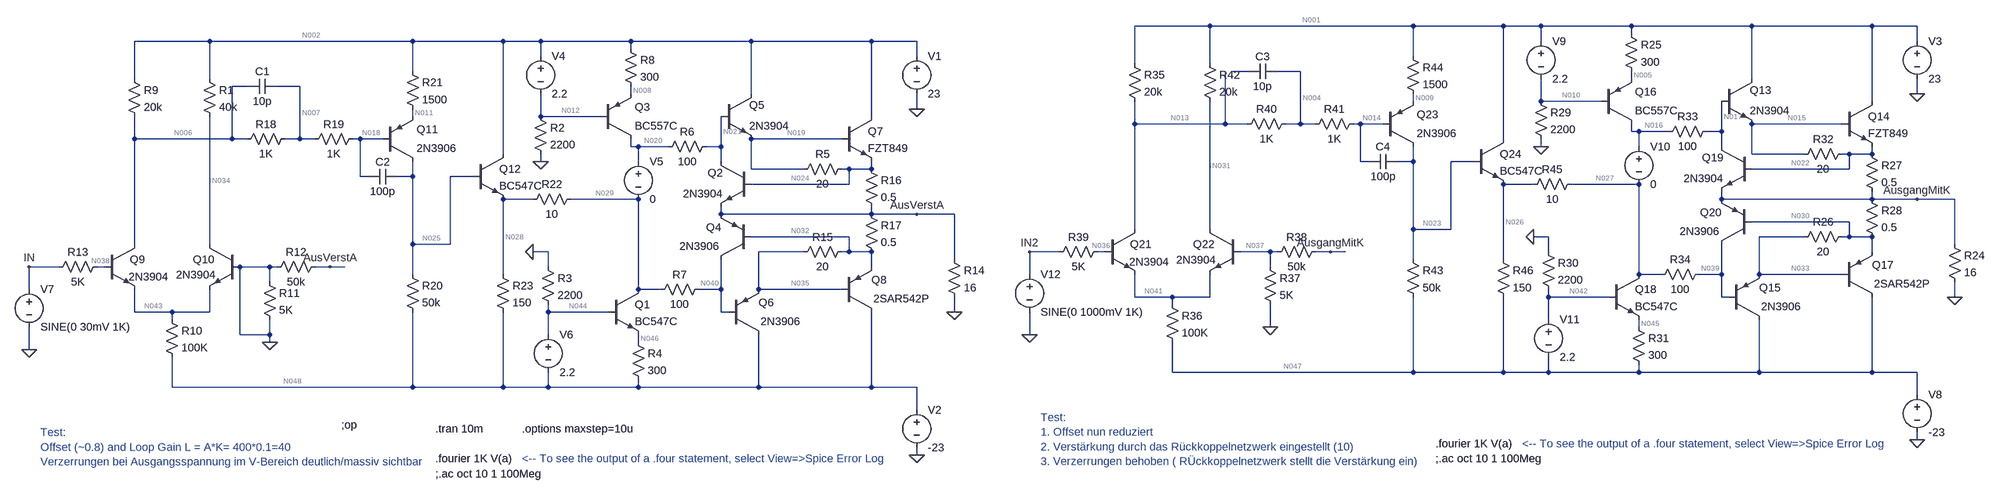
[diagram p0: schematic audioampFH2Trans.asc]
audioampFH2Trans.asc, the LTspice schematic file:
Version 4
SHEET 1 2516 2032
WIRE -448 880 -608 880
WIRE -16 880 -448 880
WIRE 176 880 -16 880
WIRE 256 880 176 880
WIRE 448 880 256 880
WIRE 704 880 448 880
WIRE 960 880 704 880
WIRE 1056 880 960 880
WIRE 448 896 448 880
WIRE -2576 912 -2736 912
WIRE -2144 912 -2576 912
WIRE -1952 912 -2144 912
WIRE -1872 912 -1952 912
WIRE -1680 912 -1872 912
WIRE -1424 912 -1680 912
WIRE -1168 912 -1424 912
WIRE -1072 912 -1168 912
WIRE 256 912 256 880
WIRE 1056 912 1056 880
WIRE -1680 928 -1680 912
WIRE -1872 944 -1872 912
WIRE -1072 944 -1072 912
WIRE -16 944 -16 880
WIRE -608 960 -608 880
WIRE -448 960 -448 880
WIRE -2144 976 -2144 912
WIRE -368 976 -400 976
WIRE -256 976 -304 976
WIRE -2736 992 -2736 912
WIRE -2576 992 -2576 912
WIRE 448 992 448 976
WIRE 704 992 704 880
WIRE -2496 1008 -2528 1008
WIRE -2384 1008 -2432 1008
WIRE -1680 1024 -1680 1008
WIRE -1424 1024 -1424 912
WIRE 1056 1024 1056 992
WIRE -16 1040 -16 1024
WIRE 256 1040 256 992
WIRE 384 1040 256 1040
WIRE 960 1040 960 880
WIRE -1072 1056 -1072 1024
WIRE -2144 1072 -2144 1056
WIRE -1872 1072 -1872 1024
WIRE -1744 1072 -1872 1072
WIRE -1168 1072 -1168 912
WIRE -608 1088 -608 1040
WIRE -416 1088 -416 976
WIRE -416 1088 -608 1088
WIRE -368 1088 -416 1088
WIRE -256 1088 -256 976
WIRE -256 1088 -288 1088
WIRE -224 1088 -256 1088
WIRE -128 1088 -144 1088
WIRE -80 1088 -128 1088
WIRE 896 1088 704 1088
WIRE 448 1104 448 1088
WIRE 464 1104 448 1104
WIRE 528 1104 464 1104
WIRE 640 1104 640 1040
WIRE 640 1104 608 1104
WIRE -2736 1120 -2736 1072
WIRE -2528 1120 -2528 1008
WIRE -2528 1120 -2736 1120
WIRE -2496 1120 -2528 1120
WIRE -2384 1120 -2384 1008
WIRE -2384 1120 -2416 1120
WIRE -2352 1120 -2384 1120
WIRE -2256 1120 -2272 1120
WIRE -2208 1120 -2256 1120
WIRE -1232 1120 -1424 1120
WIRE 176 1120 176 880
WIRE -1680 1136 -1680 1120
WIRE -1664 1136 -1680 1136
WIRE -1600 1136 -1664 1136
WIRE -1488 1136 -1488 1072
WIRE -1488 1136 -1520 1136
WIRE 256 1136 256 1120
WIRE 464 1136 464 1104
WIRE 640 1136 640 1104
WIRE -1952 1152 -1952 912
WIRE 704 1152 704 1088
WIRE 816 1152 704 1152
WIRE 912 1152 896 1152
WIRE 960 1152 960 1136
WIRE 960 1152 912 1152
WIRE -1872 1168 -1872 1152
WIRE -1664 1168 -1664 1136
WIRE -1488 1168 -1488 1136
WIRE -128 1168 -128 1088
WIRE -112 1168 -128 1168
WIRE -16 1168 -16 1136
WIRE -16 1168 -48 1168
WIRE 112 1168 64 1168
WIRE -1424 1184 -1424 1120
WIRE -1312 1184 -1424 1184
WIRE -1216 1184 -1232 1184
WIRE -1168 1184 -1168 1168
WIRE -1168 1184 -1216 1184
WIRE 912 1184 912 1152
WIRE 912 1184 704 1184
WIRE -2256 1200 -2256 1120
WIRE -2240 1200 -2256 1200
WIRE -2144 1200 -2144 1168
WIRE -2144 1200 -2176 1200
WIRE -2016 1200 -2064 1200
WIRE -1216 1216 -1216 1184
WIRE -1216 1216 -1424 1216
WIRE 240 1216 176 1216
WIRE 464 1216 320 1216
WIRE -1888 1248 -1952 1248
WIRE -1664 1248 -1808 1248
WIRE 640 1248 640 1232
WIRE 960 1248 960 1232
WIRE 960 1248 640 1248
WIRE 1056 1248 960 1248
WIRE 1136 1248 1056 1248
WIRE -1488 1280 -1488 1264
WIRE -1168 1280 -1168 1264
WIRE -1168 1280 -1488 1280
WIRE -1072 1280 -1168 1280
WIRE -992 1280 -1072 1280
WIRE 912 1296 704 1296
WIRE -608 1312 -608 1088
WIRE -448 1312 -448 1040
WIRE -16 1312 -16 1168
WIRE 64 1312 64 1168
WIRE 64 1312 -16 1312
WIRE -1216 1328 -1424 1328
WIRE 272 1328 240 1328
WIRE 816 1328 720 1328
WIRE 912 1328 912 1296
WIRE 912 1328 896 1328
WIRE 960 1328 912 1328
WIRE -2736 1344 -2736 1120
WIRE -2576 1344 -2576 1072
WIRE -2144 1344 -2144 1200
WIRE -2064 1344 -2064 1200
WIRE -2064 1344 -2144 1344
WIRE 1136 1344 1136 1248
WIRE -1856 1360 -1888 1360
WIRE -1312 1360 -1408 1360
WIRE -1216 1360 -1216 1328
WIRE -1216 1360 -1232 1360
WIRE -1168 1360 -1216 1360
WIRE -768 1360 -832 1360
WIRE -672 1360 -688 1360
WIRE -320 1360 -384 1360
WIRE -304 1360 -320 1360
WIRE -192 1360 -224 1360
WIRE -160 1360 -192 1360
WIRE 272 1360 272 1328
WIRE 960 1360 960 1328
WIRE -992 1376 -992 1280
WIRE -16 1376 -16 1312
WIRE 176 1376 176 1216
WIRE -2896 1392 -2960 1392
WIRE -2800 1392 -2816 1392
WIRE -2448 1392 -2512 1392
WIRE -2432 1392 -2448 1392
WIRE -2320 1392 -2352 1392
WIRE -2288 1392 -2320 1392
WIRE -1856 1392 -1856 1360
WIRE -1168 1392 -1168 1360
WIRE -320 1392 -320 1360
WIRE -2144 1408 -2144 1344
WIRE -1952 1408 -1952 1248
WIRE -832 1408 -832 1360
WIRE 464 1408 464 1216
WIRE 512 1408 464 1408
WIRE 640 1408 640 1344
WIRE 640 1408 592 1408
WIRE 720 1408 720 1328
WIRE 896 1408 720 1408
WIRE -2448 1424 -2448 1392
WIRE -2960 1440 -2960 1392
WIRE -1664 1440 -1664 1248
WIRE -1616 1440 -1664 1440
WIRE -1488 1440 -1488 1376
WIRE -1488 1440 -1536 1440
WIRE -1408 1440 -1408 1360
WIRE -1232 1440 -1408 1440
WIRE -608 1456 -608 1408
WIRE -528 1456 -608 1456
WIRE -448 1456 -448 1408
WIRE -448 1456 -528 1456
WIRE 272 1456 272 1440
WIRE 400 1456 272 1456
WIRE 640 1456 640 1408
WIRE 656 1456 640 1456
WIRE 1136 1456 1136 1424
WIRE -528 1472 -528 1456
WIRE -2736 1488 -2736 1440
WIRE -2656 1488 -2736 1488
WIRE -2576 1488 -2576 1440
WIRE -2576 1488 -2656 1488
WIRE -1856 1488 -1856 1472
WIRE -1728 1488 -1856 1488
WIRE -1488 1488 -1488 1440
WIRE -1472 1488 -1488 1488
WIRE -992 1488 -992 1456
WIRE -2656 1504 -2656 1488
WIRE 272 1504 272 1456
WIRE -320 1520 -320 1472
WIRE 464 1520 464 1504
WIRE -2512 1536 -2512 1392
WIRE -2448 1536 -2448 1504
WIRE -2448 1536 -2512 1536
WIRE -1856 1536 -1856 1488
WIRE -832 1536 -832 1488
WIRE -2448 1552 -2448 1536
WIRE -1664 1552 -1664 1536
WIRE -2960 1568 -2960 1520
WIRE -528 1616 -528 1552
WIRE -16 1616 -16 1456
WIRE -16 1616 -528 1616
WIRE 176 1616 176 1456
WIRE 176 1616 -16 1616
WIRE 272 1616 272 1584
WIRE 272 1616 176 1616
WIRE 464 1616 464 1600
WIRE 464 1616 272 1616
WIRE 720 1616 720 1504
WIRE 720 1616 464 1616
WIRE 960 1616 960 1456
WIRE 960 1616 720 1616
WIRE 1056 1616 960 1616
WIRE -2656 1648 -2656 1584
WIRE -2144 1648 -2144 1488
WIRE -2144 1648 -2656 1648
WIRE -1952 1648 -1952 1488
WIRE -1952 1648 -2144 1648
WIRE -1856 1648 -1856 1616
WIRE -1856 1648 -1952 1648
WIRE -1664 1648 -1664 1632
WIRE -1664 1648 -1856 1648
WIRE -1408 1648 -1408 1536
WIRE -1408 1648 -1664 1648
WIRE -1168 1648 -1168 1488
WIRE -1168 1648 -1408 1648
WIRE -1072 1648 -1168 1648
WIRE 1056 1664 1056 1616
WIRE -1072 1696 -1072 1648
WIRE 1056 1760 1056 1744
WIRE -1072 1792 -1072 1776
FLAG -1072 1056 0
FLAG -1072 1792 0
FLAG -992 1488 0
FLAG -1872 1168 0
FLAG -1888 1360 0
FLAG -1072 1280 AusVerstA
FLAG -2448 1552 0
FLAG -2960 1568 0
FLAG -2320 1392 AusVerstA
FLAG -2960 1392 IN
FLAG 1056 1024 0
FLAG 1056 1760 0
FLAG 1136 1456 0
FLAG 256 1136 0
FLAG 240 1328 0
FLAG 1056 1248 AusgangMitK
FLAG -320 1520 0
FLAG -832 1536 0
FLAG -192 1360 AusgangMitK
FLAG -832 1360 IN2
SYMBOL NPN -1488 1024 R0
WINDOW 0 60 24 Left 2
WINDOW 3 60 68 Left 2
SYMATTR InstName Q5
SYMATTR Value 2N3904
SYMBOL npn -1232 1072 R0
SYMATTR InstName Q7
SYMATTR Value FZT849
SYMBOL PNP -1472 1536 M180
WINDOW 0 64 68 Left 2
WINDOW 3 68 28 Left 2
SYMATTR InstName Q6
SYMATTR Value 2N3906
SYMBOL VOLTAGE -1072 928 R0
WINDOW 123 0 0 Left 2
WINDOW 39 0 0 Left 2
SYMATTR InstName V1
SYMATTR Value 23
SYMBOL voltage -1072 1680 R0
WINDOW 123 0 0 Left 2
WINDOW 39 0 0 Left 2
SYMATTR InstName V2
SYMATTR Value -23
SYMBOL res -1008 1360 R0
SYMATTR InstName R14
SYMATTR Value 16
SYMBOL pnp -1744 1120 M180
WINDOW 0 72 68 Left 2
WINDOW 3 72 28 Left 2
SYMATTR InstName Q3
SYMATTR Value BC557C
SYMBOL res -1696 912 R0
SYMATTR InstName R8
SYMATTR Value 300
SYMBOL PNP -1232 1488 M180
WINDOW 0 64 68 Left 2
WINDOW 3 68 28 Left 2
SYMATTR InstName Q8
SYMATTR Value 2SAR542P
SYMBOL res -1216 1344 R90
WINDOW 0 0 56 VBottom 2
WINDOW 3 32 56 VTop 2
SYMATTR InstName R15
SYMATTR Value 20
SYMBOL res -1184 1168 R0
SYMATTR InstName R16
SYMATTR Value 0.5
SYMBOL res -1184 1264 R0
SYMATTR InstName R17
SYMATTR Value 0.5
SYMBOL VOLTAGE -1872 928 R0
WINDOW 123 0 0 Left 2
WINDOW 39 0 0 Left 2
SYMATTR InstName V4
SYMATTR Value 2.2
SYMBOL res -1888 1056 R0
SYMATTR InstName R2
SYMATTR Value 2200
SYMBOL VOLTAGE -1664 1152 R0
WINDOW 123 0 0 Left 2
WINDOW 39 0 0 Left 2
SYMATTR InstName V5
SYMATTR Value 0
SYMBOL VOLTAGE -1856 1520 R0
WINDOW 123 0 0 Left 2
WINDOW 39 0 0 Left 2
SYMATTR InstName V6
SYMATTR Value 2.2
SYMBOL res -1872 1376 R0
SYMATTR InstName R3
SYMATTR Value 2200
SYMBOL res -1680 1536 R0
SYMATTR InstName R4
SYMATTR Value 300
SYMBOL npn -1728 1440 R0
SYMATTR InstName Q1
SYMATTR Value BC547C
SYMBOL res -1216 1168 R90
WINDOW 0 0 56 VBottom 2
WINDOW 3 32 56 VTop 2
SYMATTR InstName R5
SYMATTR Value 20
SYMBOL NPN -1424 1168 M0
WINDOW 0 60 24 Left 2
WINDOW 3 60 68 Left 2
SYMATTR InstName Q2
SYMATTR Value 2N3904
SYMBOL PNP -1424 1376 R180
WINDOW 0 64 68 Left 2
WINDOW 3 68 28 Left 2
SYMATTR InstName Q4
SYMATTR Value 2N3906
SYMBOL res -1504 1120 R90
WINDOW 0 0 56 VBottom 2
WINDOW 3 32 56 VTop 2
SYMATTR InstName R6
SYMATTR Value 100
SYMBOL res -1520 1424 R90
WINDOW 0 0 56 VBottom 2
WINDOW 3 32 56 VTop 2
SYMATTR InstName R7
SYMATTR Value 100
SYMBOL npn -2800 1344 R0
WINDOW 0 54 32 Left 2
WINDOW 3 52 69 Left 2
SYMATTR InstName Q9
SYMATTR Value 2N3904
SYMBOL npn -2512 1344 M0
WINDOW 0 54 32 Left 2
WINDOW 3 51 65 Left 2
SYMATTR InstName Q10
SYMATTR Value 2N3904
SYMBOL res -2752 976 R0
SYMATTR InstName R9
SYMATTR Value 20k
SYMBOL res -2672 1488 R0
SYMATTR InstName R10
SYMATTR Value 100K
SYMBOL res -2464 1408 R0
SYMATTR InstName R11
SYMATTR Value 5K
SYMBOL res -2336 1376 R90
WINDOW 0 0 56 VBottom 2
WINDOW 3 32 56 VTop 2
SYMATTR InstName R12
SYMATTR Value 50k
SYMBOL voltage -2960 1424 R0
WINDOW 123 0 0 Left 2
WINDOW 39 0 0 Left 2
SYMATTR InstName V7
SYMATTR Value SINE(0 30mV 1K)
SYMBOL res -2800 1376 R90
WINDOW 0 0 56 VBottom 2
WINDOW 3 32 56 VTop 2
SYMATTR InstName R13
SYMATTR Value 5K
SYMBOL res -2400 1104 R90
WINDOW 0 0 56 VBottom 2
WINDOW 3 32 56 VTop 2
SYMATTR InstName R18
SYMATTR Value 1K
SYMBOL cap -2432 992 R90
WINDOW 0 0 32 VBottom 2
WINDOW 3 32 32 VTop 2
SYMATTR InstName C1
SYMATTR Value 10p
SYMBOL res -2256 1104 R90
WINDOW 0 0 56 VBottom 2
WINDOW 3 32 56 VTop 2
SYMATTR InstName R19
SYMATTR Value 1K
SYMBOL res -2592 976 R0
SYMATTR InstName R1
SYMATTR Value 40k
SYMBOL res -2160 1392 R0
SYMATTR InstName R20
SYMATTR Value 50k
SYMBOL pnp -2208 1168 M180
WINDOW 0 72 68 Left 2
WINDOW 3 72 28 Left 2
SYMATTR InstName Q11
SYMATTR Value 2N3906
SYMBOL res -2160 960 R0
SYMATTR InstName R21
SYMATTR Value 1500
SYMBOL cap -2176 1184 R90
WINDOW 0 0 32 VBottom 2
WINDOW 3 32 32 VTop 2
SYMATTR InstName C2
SYMATTR Value 100p
SYMBOL res -1792 1232 R90
WINDOW 0 0 56 VBottom 2
WINDOW 3 32 56 VTop 2
SYMATTR InstName R22
SYMATTR Value 10
SYMBOL npn -2016 1152 R0
SYMATTR InstName Q12
SYMATTR Value BC547C
SYMBOL res -1968 1392 R0
SYMATTR InstName R23
SYMATTR Value 150
SYMBOL NPN 640 992 R0
WINDOW 0 60 24 Left 2
WINDOW 3 60 68 Left 2
SYMATTR InstName Q13
SYMATTR Value 2N3904
SYMBOL npn 896 1040 R0
SYMATTR InstName Q14
SYMATTR Value FZT849
SYMBOL PNP 656 1504 M180
WINDOW 0 64 68 Left 2
WINDOW 3 68 28 Left 2
SYMATTR InstName Q15
SYMATTR Value 2N3906
SYMBOL VOLTAGE 1056 896 R0
WINDOW 123 0 0 Left 2
WINDOW 39 0 0 Left 2
SYMATTR InstName V3
SYMATTR Value 23
SYMBOL voltage 1056 1648 R0
WINDOW 123 0 0 Left 2
WINDOW 39 0 0 Left 2
SYMATTR InstName V8
SYMATTR Value -23
SYMBOL res 1120 1328 R0
SYMATTR InstName R24
SYMATTR Value 16
SYMBOL pnp 384 1088 M180
WINDOW 0 72 68 Left 2
WINDOW 3 72 28 Left 2
SYMATTR InstName Q16
SYMATTR Value BC557C
SYMBOL res 432 880 R0
SYMATTR InstName R25
SYMATTR Value 300
SYMBOL PNP 896 1456 M180
WINDOW 0 64 68 Left 2
WINDOW 3 68 28 Left 2
SYMATTR InstName Q17
SYMATTR Value 2SAR542P
SYMBOL res 912 1312 R90
WINDOW 0 0 56 VBottom 2
WINDOW 3 32 56 VTop 2
SYMATTR InstName R26
SYMATTR Value 20
SYMBOL res 944 1136 R0
SYMATTR InstName R27
SYMATTR Value 0.5
SYMBOL res 944 1232 R0
SYMATTR InstName R28
SYMATTR Value 0.5
SYMBOL VOLTAGE 256 896 R0
WINDOW 123 0 0 Left 2
WINDOW 39 0 0 Left 2
SYMATTR InstName V9
SYMATTR Value 2.2
SYMBOL res 240 1024 R0
SYMATTR InstName R29
SYMATTR Value 2200
SYMBOL VOLTAGE 464 1120 R0
WINDOW 123 0 0 Left 2
WINDOW 39 0 0 Left 2
SYMATTR InstName V10
SYMATTR Value 0
SYMBOL VOLTAGE 272 1488 R0
WINDOW 123 0 0 Left 2
WINDOW 39 0 0 Left 2
SYMATTR InstName V11
SYMATTR Value 2.2
SYMBOL res 256 1344 R0
SYMATTR InstName R30
SYMATTR Value 2200
SYMBOL res 448 1504 R0
SYMATTR InstName R31
SYMATTR Value 300
SYMBOL npn 400 1408 R0
SYMATTR InstName Q18
SYMATTR Value BC547C
SYMBOL res 912 1136 R90
WINDOW 0 0 56 VBottom 2
WINDOW 3 32 56 VTop 2
SYMATTR InstName R32
SYMATTR Value 20
SYMBOL NPN 704 1136 M0
WINDOW 0 60 24 Left 2
WINDOW 3 60 68 Left 2
SYMATTR InstName Q19
SYMATTR Value 2N3904
SYMBOL PNP 704 1344 R180
WINDOW 0 64 68 Left 2
WINDOW 3 68 28 Left 2
SYMATTR InstName Q20
SYMATTR Value 2N3906
SYMBOL res 624 1088 R90
WINDOW 0 0 56 VBottom 2
WINDOW 3 32 56 VTop 2
SYMATTR InstName R33
SYMATTR Value 100
SYMBOL res 608 1392 R90
WINDOW 0 0 56 VBottom 2
WINDOW 3 32 56 VTop 2
SYMATTR InstName R34
SYMATTR Value 100
SYMBOL npn -672 1312 R0
WINDOW 0 54 32 Left 2
WINDOW 3 52 69 Left 2
SYMATTR InstName Q21
SYMATTR Value 2N3904
SYMBOL npn -384 1312 M0
WINDOW 0 54 32 Left 2
WINDOW 3 51 65 Left 2
SYMATTR InstName Q22
SYMATTR Value 2N3904
SYMBOL res -624 944 R0
SYMATTR InstName R35
SYMATTR Value 20k
SYMBOL res -544 1456 R0
SYMATTR InstName R36
SYMATTR Value 100K
SYMBOL res -336 1376 R0
SYMATTR InstName R37
SYMATTR Value 5K
SYMBOL res -208 1344 R90
WINDOW 0 0 56 VBottom 2
WINDOW 3 32 56 VTop 2
SYMATTR InstName R38
SYMATTR Value 50k
SYMBOL voltage -832 1392 R0
WINDOW 123 0 0 Left 2
WINDOW 39 0 0 Left 2
SYMATTR InstName V12
SYMATTR Value SINE(0 1000mV 1K)
SYMBOL res -672 1344 R90
WINDOW 0 0 56 VBottom 2
WINDOW 3 32 56 VTop 2
SYMATTR InstName R39
SYMATTR Value 5K
SYMBOL res -272 1072 R90
WINDOW 0 0 56 VBottom 2
WINDOW 3 32 56 VTop 2
SYMATTR InstName R40
SYMATTR Value 1K
SYMBOL cap -304 960 R90
WINDOW 0 0 32 VBottom 2
WINDOW 3 32 32 VTop 2
SYMATTR InstName C3
SYMATTR Value 10p
SYMBOL res -128 1072 R90
WINDOW 0 0 56 VBottom 2
WINDOW 3 32 56 VTop 2
SYMATTR InstName R41
SYMATTR Value 1K
SYMBOL res -464 944 R0
SYMATTR InstName R42
SYMATTR Value 20k
SYMBOL res -32 1360 R0
SYMATTR InstName R43
SYMATTR Value 50k
SYMBOL pnp -80 1136 M180
WINDOW 0 72 68 Left 2
WINDOW 3 72 28 Left 2
SYMATTR InstName Q23
SYMATTR Value 2N3906
SYMBOL res -32 928 R0
SYMATTR InstName R44
SYMATTR Value 1500
SYMBOL cap -48 1152 R90
WINDOW 0 0 32 VBottom 2
WINDOW 3 32 32 VTop 2
SYMATTR InstName C4
SYMATTR Value 100p
SYMBOL res 336 1200 R90
WINDOW 0 0 56 VBottom 2
WINDOW 3 32 56 VTop 2
SYMATTR InstName R45
SYMATTR Value 10
SYMBOL npn 112 1120 R0
SYMATTR InstName Q24
SYMATTR Value BC547C
SYMBOL res 160 1360 R0
SYMATTR InstName R46
SYMATTR Value 150
TEXT -2096 1736 Left 2 !.tran 10m
TEXT -1912 1736 Left 2 !.options maxstep=10u
TEXT -2096 1832 Left 2 !;.ac oct 10 1 100Meg
TEXT -2096 1800 Left 2 !.fourier 1K V(a)
TEXT -1912 1800 Left 2 ;<-- To see the output of a .four statement, select View=>Spice Error Log
TEXT -2296 1728 Left 2 !;op
TEXT -2936 1744 Left 2 ;Test:\nOffset (~0.8) and Loop Gain L = A*K= 400*0.1=40\nVerzerrungen bei Ausgangsspannung im V-Bereich deutlich/massiv sichtbar
TEXT 32 1800 Left 2 !;.ac oct 10 1 100Meg
TEXT 32 1768 Left 2 !.fourier 1K V(a)
TEXT 216 1768 Left 2 ;<-- To see the output of a .four statement, select View=>Spice Error Log
TEXT -808 1712 Left 2 ;Test:\n1. Offset nun reduziert\n2. Verstärkung durch das Rückkoppelnetzwerk eingestellt (10)\n3. Verzerrungen behoben ( RÜckkoppelnetzwerk stellt die Verstärkung ein)

The netlist it stands for:
* audioampFH2Trans.asc
Q5 N002 N021 N019 0 2N3904
Q7 N002 N019 N024 0 FZT849
Q6 N048 N040 N035 0 2N3906
V1 N002 0 23
V2 N048 0 -23
R14 AusVerstA 0 16
Q3 N020 N012 N008 0 BC557C
R8 N002 N008 300
Q8 N048 N035 N032 0 2SAR542P
R15 N032 N035 20
R16 N024 AusVerstA 0.5
R17 AusVerstA N032 0.5
V4 N002 N012 2.2
R2 N012 0 2200
V5 N020 N029 0
V6 N044 N048 2.2
R3 0 N044 2200
R4 N046 N048 300
Q1 N029 N044 N046 0 BC547C
R5 N024 N019 20
Q2 N021 N024 AusVerstA 0 2N3904
Q4 N040 N032 AusVerstA 0 2N3906
R6 N021 N020 100
R7 N040 N029 100
Q9 N006 N038 N043 0 2N3904
Q10 N034 0 N043 0 2N3904
R9 N002 N006 20k
R10 N043 N048 100K
R11 0 0 5K
R12 AusVerstA 0 50k
V7 IN 0 SINE(0 30mV 1K)
R13 N038 IN 5K
R18 N007 N006 1K
C1 N007 N006 10p
R19 N018 N007 1K
R1 N002 N034 40k
R20 N025 N048 50k
Q11 N025 N018 N011 0 2N3906
R21 N002 N011 1500
C2 N025 N018 100p
R22 N029 N028 10
Q12 N002 N025 N028 0 BC547C
R23 N028 N048 150
Q13 N001 N017 N015 0 2N3904
Q14 N001 N015 N022 0 FZT849
Q15 N047 N039 N033 0 2N3906
V3 N001 0 23
V8 N047 0 -23
R24 AusgangMitK 0 16
Q16 N016 N010 N005 0 BC557C
R25 N001 N005 300
Q17 N047 N033 N030 0 2SAR542P
R26 N030 N033 20
R27 N022 AusgangMitK 0.5
R28 AusgangMitK N030 0.5
V9 N001 N010 2.2
R29 N010 0 2200
V10 N016 N027 0
V11 N042 N047 2.2
R30 0 N042 2200
R31 N045 N047 300
Q18 N027 N042 N045 0 BC547C
R32 N022 N015 20
Q19 N017 N022 AusgangMitK 0 2N3904
Q20 N039 N030 AusgangMitK 0 2N3906
R33 N017 N016 100
R34 N039 N027 100
Q21 N013 N036 N041 0 2N3904
Q22 N031 N037 N041 0 2N3904
R35 N001 N013 20k
R36 N041 N047 100K
R37 N037 0 5K
R38 AusgangMitK N037 50k
V12 IN2 0 SINE(0 1000mV 1K)
R39 N036 IN2 5K
R40 N004 N013 1K
C3 N004 N003 10p
R41 N014 N004 1K
R42 N001 N031 20k
R43 N023 N047 50k
Q23 N023 N014 N009 0 2N3906
R44 N001 N009 1500
C4 N023 N014 100p
R45 N027 N026 10
Q24 N001 N023 N026 0 BC547C
R46 N026 N047 150
.model NPN NPN
.model PNP PNP
.lib standard.bjt
.tran 10m
.options maxstep=10u
;.ac oct 10 1 100Meg
.fourier 1K V(a)
* <-- To see the output of a .four statement, select View=>Spice Error Log
;op
* Test:
* Offset (~0.8) and Loop Gain L = A*K= 400*0.1=40
* Verzerrungen bei Ausgangsspannung im V-Bereich deutlich/massiv sichtbar
;.ac oct 10 1 100Meg
.fourier 1K V(a)
* <-- To see the output of a .four statement, select View=>Spice Error Log
* Test:
* 1. Offset nun reduziert
* 2. Verstärkung durch das Rückkoppelnetzwerk eingestellt (10)
* 3. Verzerrungen behoben ( RÜckkoppelnetzwerk stellt die Verstärkung ein)
.backanno
.end

* Results of the author's LTspice run, read from the files saved beside the schematic
* Operating Point, zero values left out:
*   V(n002) = 23 V
*   V(n021) = 1.039 V
*   V(n019) = 333.3 mV
*   V(n024) = 168.3 mV
*   V(n048) = -23 V
*   V(n040) = 840.3 mV
*   V(n035) = 164.4 mV
*   V(ausversta) = 164.2 mV
*   V(n020) = 1.042 V
*   V(n012) = 20.8 V
*   V(n008) = 21.45 V
*   V(n032) = 164.4 mV
*   V(n029) = 1.042 V
*   V(n044) = -20.8 V
*   V(n046) = -21.46 V
*   V(n006) = 20.89 V
*   V(n038) = -1.511 mV
*   V(n043) = -594.6 mV
*   V(n034) = 18.45 V
*   V(n007) = 20.89 V
*   V(n018) = 20.9 V
*   V(n025) = 1.866 V
*   V(n011) = 21.55 V
*   V(n028) = 1.062 V
*   V(n001) = 23 V
*   V(n017) = 693.2 mV
*   V(n015) = 43.15 mV
*   V(n022) = 23.18 mV
*   V(n047) = -23 V
*   V(n039) = 651.5 mV
*   V(n033) = 22.72 mV
*   V(ausgangmitk) = 22.68 mV
*   V(n016) = 693.4 mV
*   V(n010) = 20.8 V
*   V(n005) = 21.45 V
*   V(n030) = 22.72 mV
*   V(n027) = 693.4 mV
*   V(n042) = -20.8 V
*   V(n045) = -21.46 V
*   V(n013) = 20.93 V
*   V(n036) = -1.48 mV
*   V(n041) = -594 mV
*   V(n031) = 20.68 V
*   V(n037) = 603.9 µV
*   V(n004) = 20.94 V
*   V(n014) = 20.94 V
*   V(n023) = 1.499 V
*   V(n009) = 21.59 V
*   V(n026) = 697.3 mV
*   Ic(Q24) = 157.9 mA
*   Ib(Q24) = 447 µA
*   Ie(Q24) = -158.4 mA
*   Ic(Q18) = 5.134 mA
*   Ib(Q18) = 8.195 µA
*   Ie(Q18) = -5.143 mA
*   Ic(Q12) = 162 mA
*   Ib(Q12) = 467.1 µA
*   Ie(Q12) = -162.4 mA
*   Ic(Q1) = 5.135 mA
*   Ib(Q1) = 8.157 µA
*   Ie(Q1) = -5.143 mA
*   Ic(Q17) = -48.58 pA
*   Ib(Q17) = 46.97 pA
*   Ie(Q17) = 1.58 pA
*   Ic(Q8) = -48.66 pA
*   Ib(Q8) = 47.11 pA
*   Ie(Q8) = 1.583 pA
*   Ic(Q16) = -5.166 mA
*   Ib(Q16) = -6.386 µA
*   Ie(Q16) = 5.172 mA
*   Ic(Q3) = -5.165 mA
*   Ib(Q3) = -6.438 µA
*   Ie(Q3) = 5.172 mA
*   Ic(Q23) = -937 µA
*   Ib(Q23) = -3.93 µA
*   Ie(Q23) = 940.9 µA
*   Ic(Q20) = 419.6 µA
*   Ib(Q20) = -84.34 µA
*   Ie(Q20) = -335.2 µA
*   Ic(Q15) = -23.63 pA
*   Ib(Q15) = 24.28 pA
*   Ic(Q11) = -964.4 µA
*   Ib(Q11) = -4.059 µA
*   Ie(Q11) = 968.5 µA
*   Ic(Q4) = 2.015 mA
*   Ib(Q4) = -405.1 µA
*   Ie(Q4) = -1.61 mA
*   Ic(Q6) = -23.84 pA
*   Ib(Q6) = 24.52 pA
*   Ic(Q14) = 24.87 pA
*   Ib(Q14) = -23.32 pA
*   Ie(Q14) = -1.771 pA
*   Ic(Q7) = 475.6 pA
*   Ib(Q7) = -2.551 pA
*   Ie(Q7) = -472.8 pA
*   Ic(Q22) = 116.1 µA
*   Ib(Q22) = 320.7 nA
*   Ie(Q22) = -116.4 µA
*   Ic(Q21) = 107.3 µA
*   Ib(Q21) = 295.9 nA
*   Ie(Q21) = -107.6 µA
*   Ic(Q13) = 995.6 µA
*   Ib(Q13) = 2.719 µA
*   Ie(Q13) = -998.4 µA
*   Ic(Q10) = 113.8 µA
*   Ib(Q10) = 320.4 nA
*   Ie(Q10) = -114.2 µA
*   Ic(Q9) = 109.6 µA
*   Ib(Q9) = 302.2 nA
*   Ie(Q9) = -109.9 µA
*   Ic(Q5) = 8.226 mA
*   Ib(Q5) = 22.86 µA
*   Ie(Q5) = -8.249 mA
*   I(R46) = 158 mA
*   I(R45) = -390.8 µA
*   I(R44) = 940.9 µA
*   I(R43) = 490 µA
*   I(R42) = 116.1 µA
*   I(R41) = 3.93 µA
*   I(R40) = 3.93 µA
*   I(R39) = -295.9 nA
*   I(R38) = 441.5 nA
*   I(R37) = 120.8 nA
*   I(R36) = 224.1 µA
*   I(R35) = 103.4 µA
*   I(R34) = -419.6 µA
*   I(R33) = -2.719 µA
*   I(R32) = -998.4 µA
*   I(R31) = 5.143 mA
*   I(R30) = 9.455 mA
*   I(R29) = 9.455 mA
*   I(R28) = -84.34 µA
*   I(R27) = 998.4 µA
*   I(R26) = 46.34 pA
*   I(R25) = 5.172 mA
*   I(R24) = 1.417 mA
*   I(R23) = 160.4 mA
*   I(R22) = -2.007 mA
*   I(R21) = 968.5 µA
*   I(R20) = 497.3 µA
*   I(R1) = 113.8 µA
*   I(R19) = 4.059 µA
*   I(R18) = 4.059 µA
*   I(R13) = -302.2 nA
*   I(R12) = 3.283 µA
*   I(R10) = 224.1 µA
*   I(R9) = 105.5 µA
*   I(R7) = -2.015 mA
*   I(R6) = -22.86 µA
*   I(R5) = -8.249 mA
*   I(R4) = 5.143 mA
*   I(R3) = 9.455 mA
*   I(R2) = 9.455 mA
*   I(R17) = -405.1 µA
*   I(R16) = 8.249 mA
*   I(R15) = 46.44 pA
*   I(R8) = 5.172 mA
*   I(R14) = 10.26 mA
*   I(V12) = -295.9 nA
*   I(V11) = 9.446 mA
*   I(V10) = 5.163 mA
*   I(V9) = 9.448 mA
*   I(V8) = 173.3 mA
*   I(V3) = -174.7 mA
*   I(V7) = -302.2 nA
*   I(V6) = 9.446 mA
*   I(V5) = 5.142 mA
*   I(V4) = 9.448 mA
*   I(V2) = 175.7 mA
*   I(V1) = -186 mA
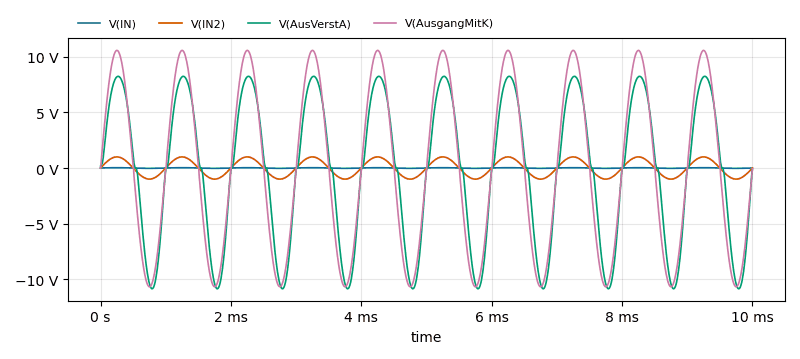
[diagram p1: Transient Analysis of audioampFH2Trans.asc, plotted from the saved traces]
* Transient Analysis, 1 run:
*   V(IN): min -29.97 mV, max 29.97 mV, average -524.2 nV, rms 21.19 mV, last 0 V
*   V(IN2): min -999 mV, max 999 mV, average -17.47 µV, rms 706.4 mV, last 0 V
*   V(AusVerstA): min -10.86 V, max 8.244 V, average -303 mV, rms 6.598 V, last -162.3 mV
*   V(AusgangMitK): min -10.68 V, max 10.58 V, average -5.339 mV, rms 7.514 V, last -56.42 mV